# Altium schematic sheet USB Power.SchDoc: USB Adapter for Rigol DP832
size A4; SheetNumber: 1; SheetTotal: 1
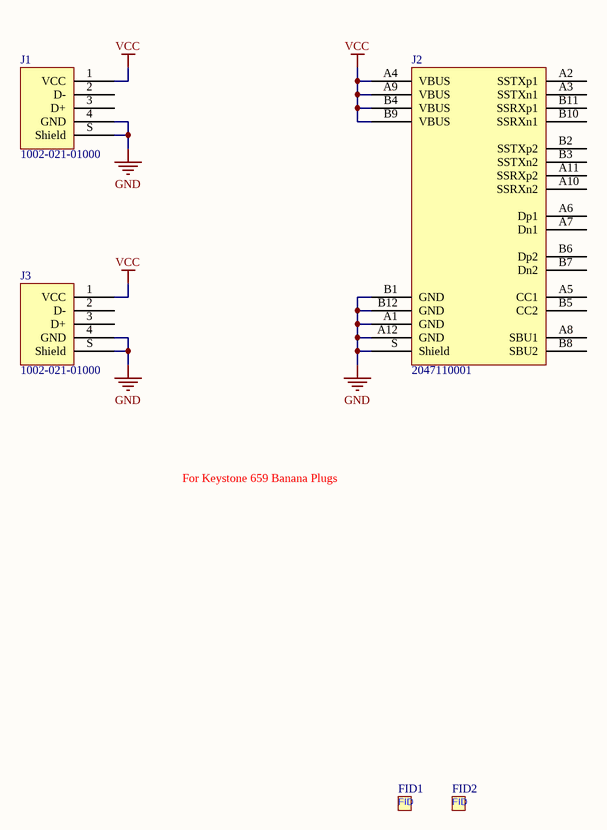
[diagram p0: USB Power.SchDoc]

## Parts
FID1  Fiducial  [Fiducial-1mm]  (value not drawn)  (no BOM)
FID2  Fiducial  [Fiducial-1mm]  (value not drawn)  (no BOM)
J1  1002-021-01000  [CNC TECH 1002-021-01000]
J2  2047110001  [Molex 2047110001]
J3  1002-021-01000  [CNC TECH 1002-021-01000]

## Nets
GND: J1.4(GND) J1.S(Shield) J2.A1(GND) J2.A12(GND) J2.B1(GND) J2.B12(GND) J2.S(Shield) J3.4(GND) J3.S(Shield)
VCC: J1.1(VCC) J2.A4(VBUS) J2.A9(VBUS) J2.B4(VBUS) J2.B9(VBUS) J3.1(VCC)

Not connected (* = marked no-connect by the designer): J1 2(D-) 3(D+); J2 A2(SSTXp1) A3(SSTXn1) A5(CC1) A6(Dp1) A7(Dn1) A8(SBU1) A10(SSRXn2) A11(SSRXp2) B2(SSTXp2) B3(SSTXn2) B5(CC2) B6(Dp2) B7(Dn2) B8(SBU2) B10(SSRXn1) B11(SSRXp1); J3 2(D-) 3(D+)

## Notes on the sheet
- For Keystone 659 Banana Plugs
- Title
- Size:
- Date:
- A4
- Number:
- Time:
- Revision:
- Sheet
- of
- File:
- (in symbol CMP-002-000000-1) FID

## Library data of the parts
FID1 FID2 = CMP-002-000000-1: Design Item ID: Fiducial; Component Type: Standard; Source: Fiducial.SchLib; Pin Count: 0
J1 J3 = 1002-021-01000: CONN RCPT USB2.0 TYPEA 4POS VERT; Manufacturer: CNC Tech; Connector Type: USB - A; Current Rating (Amps): 1.5A; Gender: Receptacle; Mating Cycles: 1500; Number of Contacts: 4; Number of Ports: 1; Voltage - Rated: 30V; Part Number: 1002-021-01000; ComponentLink1Description: Datasheet; ComponentLink1URL: http://www.cnctech.us/pdfs/1002-021-01000.pdf; ComponentLink2Description: DigiKey Link; ComponentLink2URL: http://digikey.com/product-detail/en/cnc-tech/1002-021-01000/1175-1265-ND/3466946; Features: Board Lock; LastUpdated: 30/04/2020 12:00:08; Lifecycle Status: Active; Minimum Order: 1; Mounting Feature: Vertical; Mounting Type: Through Hole; Operating Temperature: -55°C ~ 85°C; Packaging: Tray; Part Status: Active; Price: 1.02; Series: -; Specifications: USB 2.0; Supplier 1: DigiKey; Supplier Part Number 1: 1175-1265-ND; Termination: Solder
J2 = 2047110001: USB VERTICAL TYPE C 3.1; Manufacturer: Molex; Connector Type: USB - C (Type - C); Current Rating (Amps): 0.25A, 1.25A, 5A; Gender: Receptacle; Mating Cycles: 10000; Number of Contacts: 24; Number of Ports: 1; Shielding: Shielded; Specifications: USB 3.1 (USB 3.1 Gen 2, Superspeed+); Voltage - Rated: 30VAC/DC; Part Number: 2047110001; ComponentLink1Description: Datasheet; ComponentLink1URL: https://www.molex.com/webdocs/datasheets/pdf/en-us/2047110001_IO_CONNECTORS.pdf; ComponentLink2Description: DigiKey Link; ComponentLink2URL: http://digikey.com/product-detail/en/molex/2047110001/900-2047110001CT-ND/10440494; Features: Board Lock, Pick and Place Cap; LastUpdated: 06/06/2020 02:12:39; Lifecycle Status: Active; Minimum Order: 1; Mounting Feature: Vertical; Mounting Type: Surface Mount, Through Hole; Operating Temperature: -30°C ~ 85°C; Packaging: CutTape; Part Status: Active; Price: 1.78; Series: 204711; Supplier 1: DigiKey; Supplier Part Number 1: 900-2047110001CT-ND; Termination: Solder